# EAGLE design OSSIICB (EAGLE 6.1)
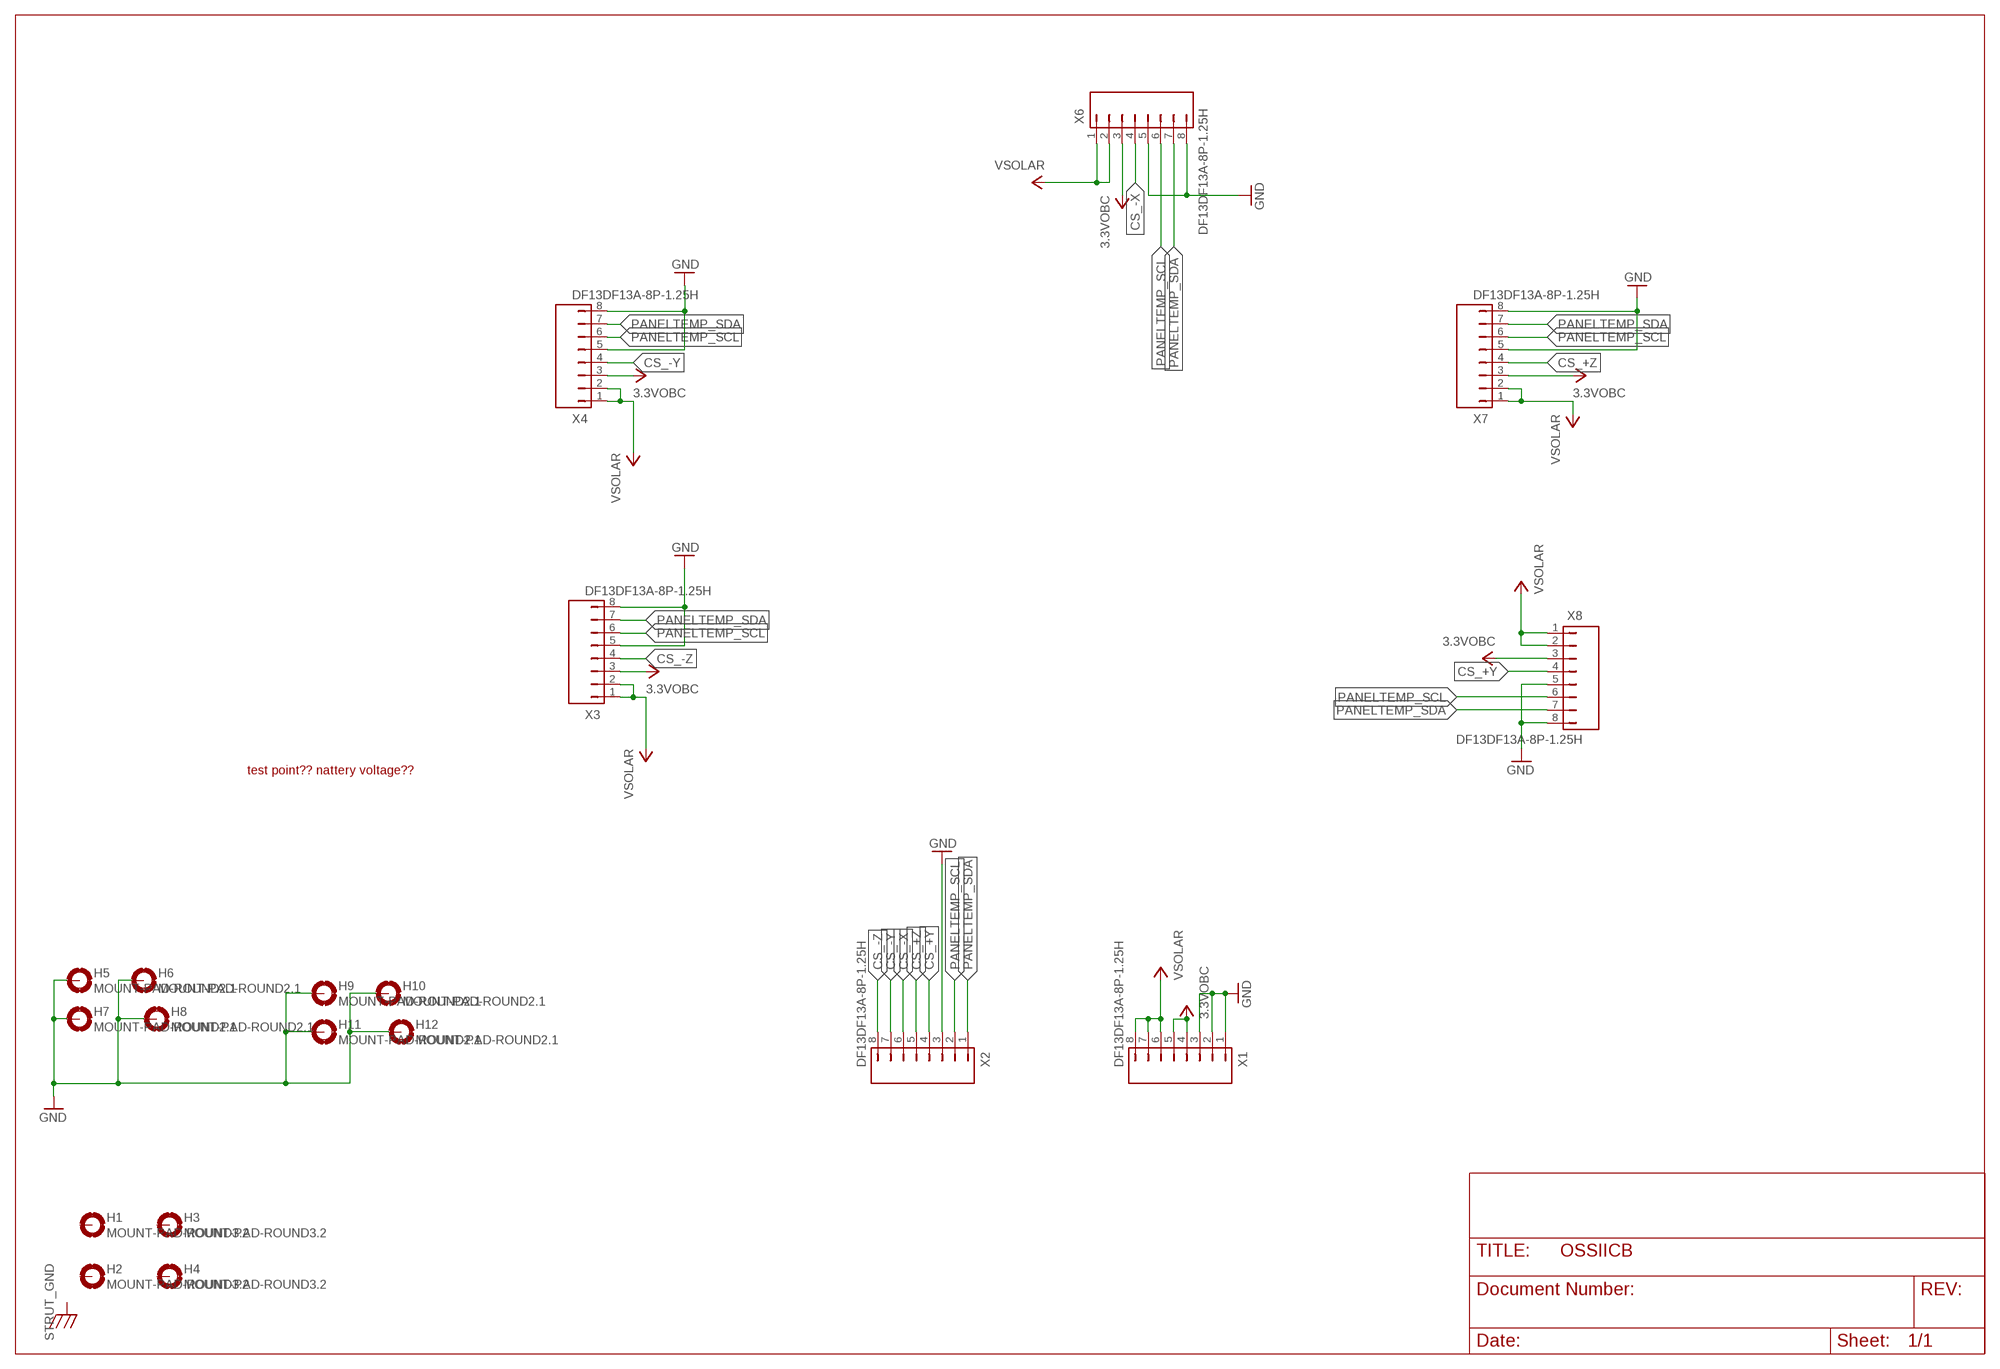
[diagram p0: schematic, sheet 1]

## Parts
H1  MOUNT-PAD-ROUND3.2  [3.2-PAD-ROUND]
H2  MOUNT-PAD-ROUND3.2  [3.2-PAD-ROUND]
H3  MOUNT-PAD-ROUND3.2  [3.2-PAD-ROUND]
H4  MOUNT-PAD-ROUND3.2  [3.2-PAD-ROUND]
H5  MOUNT-PAD-ROUND2.1  [2.1-PAD-ROUND]
H6  MOUNT-PAD-ROUND2.1  [2.1-PAD-ROUND]
H7  MOUNT-PAD-ROUND2.1  [2.1-PAD-ROUND]
H8  MOUNT-PAD-ROUND2.1  [2.1-PAD-ROUND]
H9  MOUNT-PAD-ROUND2.1  [2.1-PAD-ROUND]
H10  MOUNT-PAD-ROUND2.1  [2.1-PAD-ROUND]
H11  MOUNT-PAD-ROUND2.1  [2.1-PAD-ROUND]
H12  MOUNT-PAD-ROUND2.1  [2.1-PAD-ROUND]
X1  DF13DF13A-8P-1.25H  [DF13A-8P]
X2  DF13DF13A-8P-1.25H  [DF13A-8P]
X3  DF13DF13A-8P-1.25H  [DF13A-8P]
X4  DF13DF13A-8P-1.25H  [DF13A-8P]
X6  DF13DF13A-8P-1.25H  [DF13A-8P]
X7  DF13DF13A-8P-1.25H  [DF13A-8P]
X8  DF13DF13A-8P-1.25H  [DF13A-8P]

## Nets
3.3VOBC: X1.4 X1.5 X3.3 X4.3 X6.3 X7.3 X8.3
CS_+Y: X2.4 X8.4
CS_+Z: X2.5 X7.4
CS_-X: X2.6 X6.4
CS_-Y: X2.7 X4.4
CS_-Z: X2.8 X3.4
GND: H5.B3,2(MOUNT) H6.B3,2(MOUNT) H7.B3,2(MOUNT) H8.B3,2(MOUNT) H9.B3,2(MOUNT) H10.B3,2(MOUNT) H11.B3,2(MOUNT) H12.B3,2(MOUNT) X1.1 X1.2 X1.3 X2.3 X3.5 X3.8 X4.5 X4.8 X6.5 X6.8 X7.5 X7.8 X8.5 X8.8
PANELTEMP_SCL: X2.2 X3.6 X4.6 X6.6 X7.6 X8.6
PANELTEMP_SDA: X2.1 X3.7 X4.7 X6.7 X7.7 X8.7
VSOLAR: X1.6 X1.7 X1.8 X3.1 X3.2 X4.1 X4.2 X6.1 X6.2 X7.1 X7.2 X8.1 X8.2
Unconnected: H1.B3,2(MOUNT) H2.B3,2(MOUNT) H3.B3,2(MOUNT) H4.B3,2(MOUNT)

## Notes on the sheet
- test point?? nattery voltage??

## Library data of the parts
H1-H12 = OSSI:MOUNT-PAD-ROUND
X1-X4 X6-X8 = OSSI:DF13: Hirose DF13 series connector

## Board
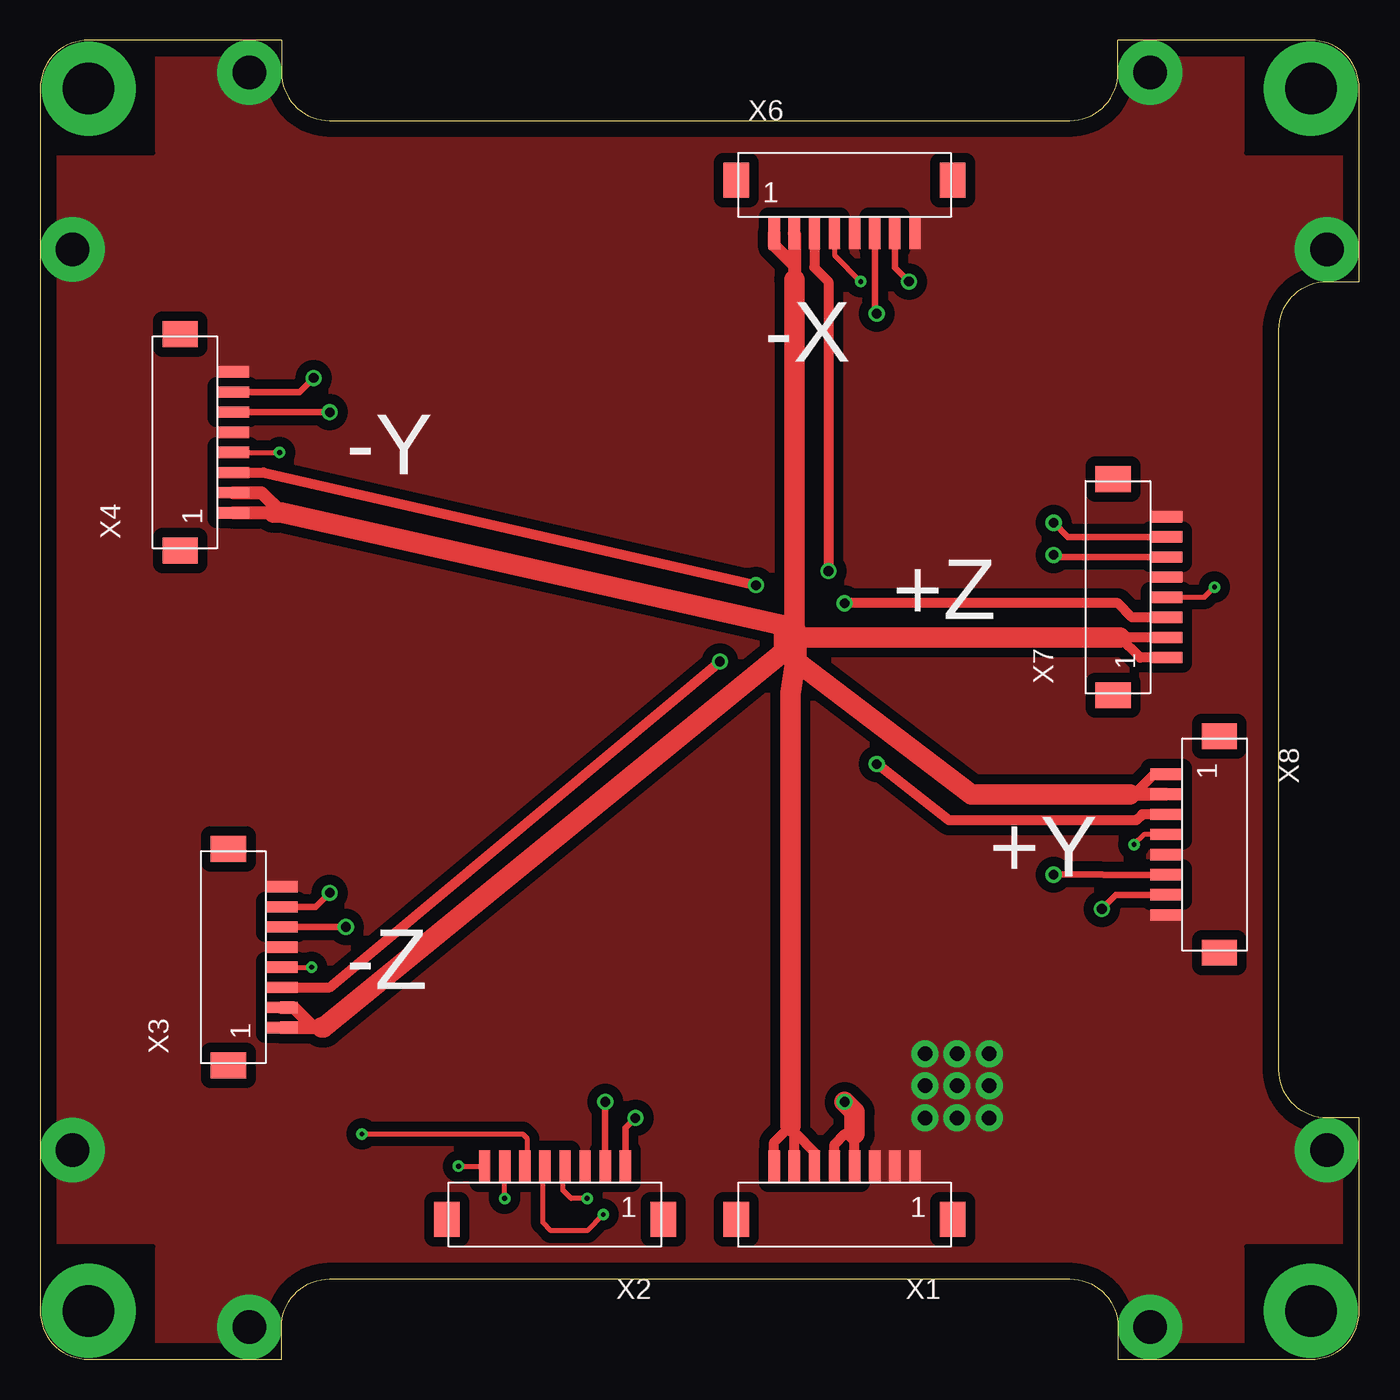
[diagram p1: board, top side]
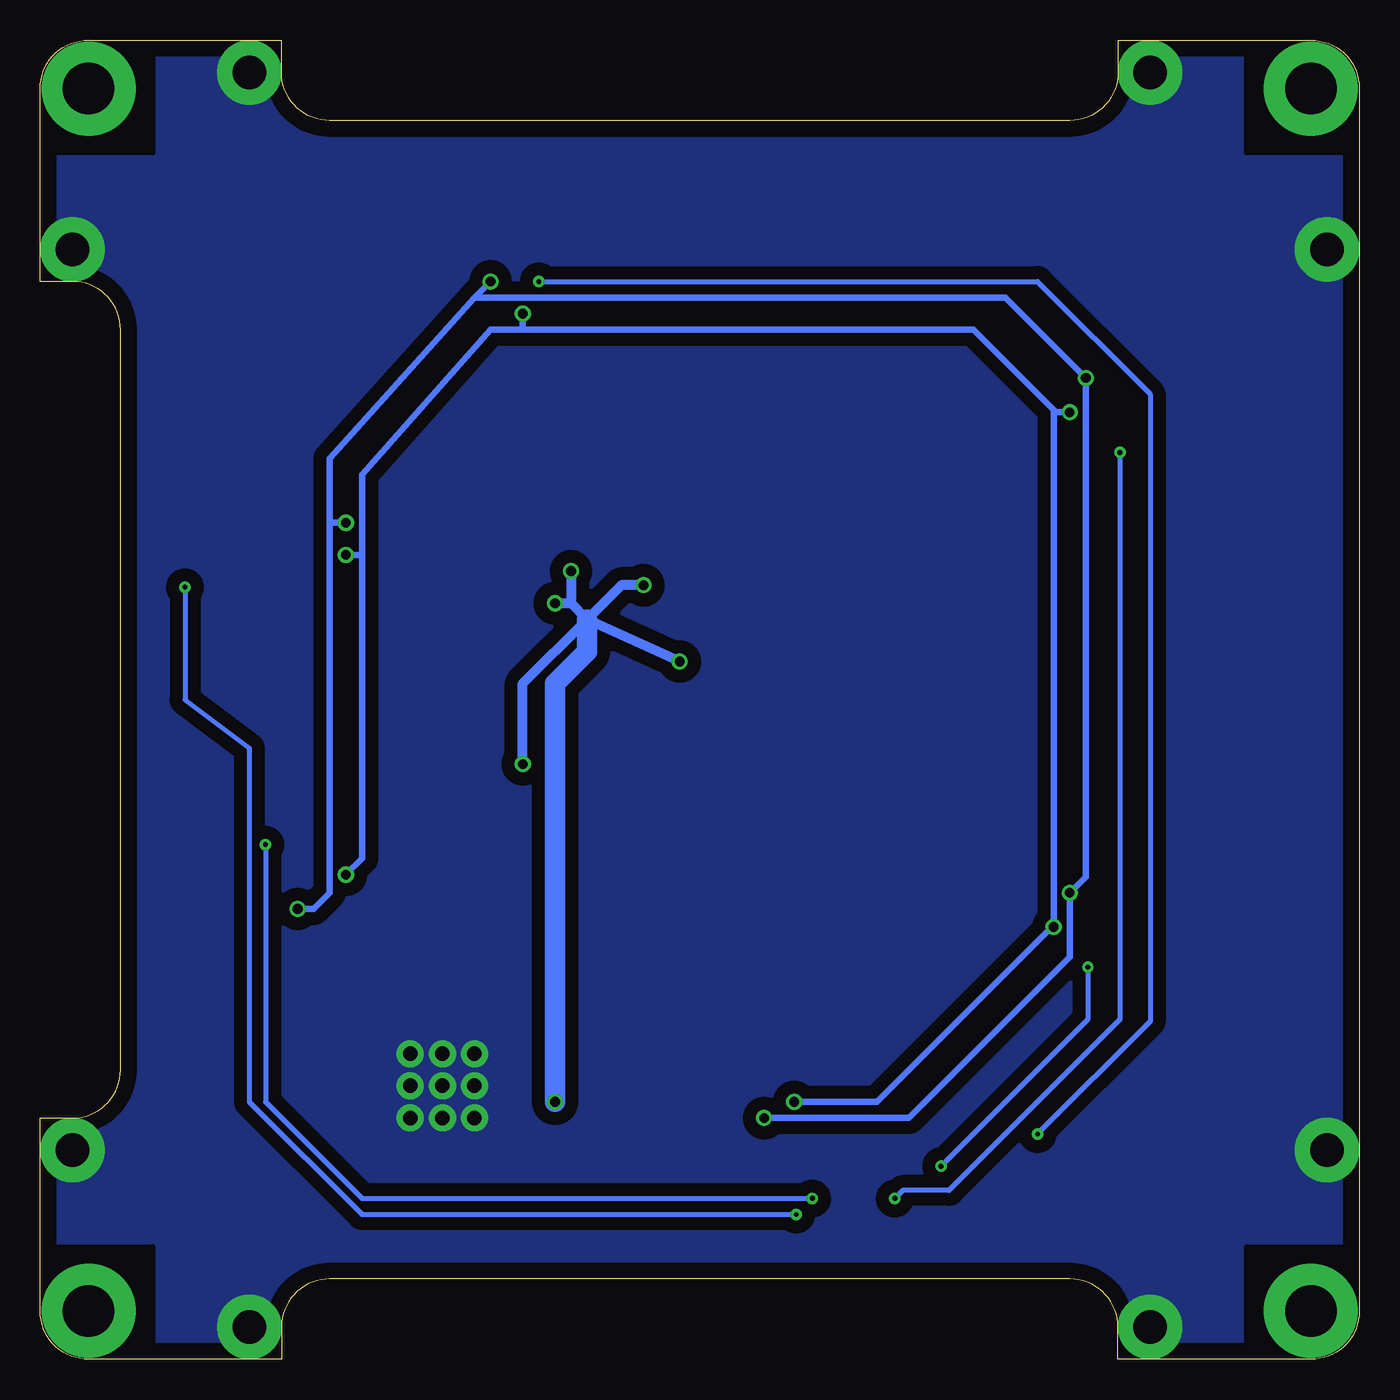
[diagram p2: board, bottom side, seen from below]

Size 82 x 82 mm. Coordinates in mm from the lower left corner, seen from the top.
Outline: 0,15 0,3 arc90 3,0 15,0 15,2 arc-90 18,5 64,5 arc-90 67,2 67,0 79,0 arc90 82,3 82,15 80,15 arc-90 77,18 77,64 arc-90 80,67 82,67 82,79 arc90 79,82 67,82 67,80 arc-90 64,77 18,77 arc-90 15,80 15,82 3,82 arc90 0,79 0,15
Copper layers (1*16): Top 0.035mm / dielectric 1.5mm / Bottom 0.035mm
Design rules: minimum track width 10mil, minimum drill 24mil, track to track 8mil, track to pad 8mil, pad to pad 8mil, via to via 8mil, smd to smd 8mil, copper to edge 40mil, drill to drill 8mil, minimum pad ring 10mil, minimum via ring 8mil, stop-mask expansion 4mil, vias tented up to drill 0mil, thermal gap 10mil

### Footprints (pad centres in the part's own frame; a part is rotated, then mirrored left to right if it is on the bottom)
3.2-PAD-ROUND = drill 3.2 pad 5.842: B3,2 0,0
2.1-PAD-ROUND = drill 2.1 pad 4: B3,2 0,0
DF13A-8P = smd 0.7 x 2: 1 -4.375,0; 2 -3.125,0; 3 -1.875,0; 4 -0.625,0; 5 0.625,0; 6 1.875,0; 7 3.125,0; 8 4.375,0 | smd 1.6 x 2.2: P$1 -6.725,3.3; P$2 6.725,3.3

### Placement (x,y rotation side)
H1  3,3 0 top
H2  3,79 0 top
H3  79,79 0 top
H4  79,3 0 top
H5  69,2 0 top
H6  13,2 0 top
H7  2,13 0 top
H8  2,69 0 top
H9  13,80 0 top
H10  80,69 0 top
H11  69,80 0 top
H12  80,13 0 top
X1  50,12 180 top
X2  32,12 180 top
X3  15,25 90 top
X4  12,57 90 top
X6  50,70 0 top
X7  70,48 90 top
X8  70,32 270 top

### Tracks (layer width: path | path; a pad name or v marks a point on that pad's centre or on a via)
3.3VOBC  (via drill 0.6)
  Top 0.61: X1.4 50.62,14 50,14 49.38,13.38 X1.5 | X7.3 67.88,46.12 67,47 v50,47 | X6.3 48.12,67.88 49,67 v49,49 | X4.3 13.88,55.12 v44.5,48.12 | X3.3 18,23.12 v42.25,43.38 | X8.3 68.5,33.88 68.12,33.5 56.5,33.5 v52,37
  Top 1.27: 50.62,14 50.62,15.38 v50,16
  Bottom 0.61: 48,46 49,47 | v50,47 49,47 | v49,49 49,47 | v44.5,48.12 45.88,48.12 48,46 | v42.25,43.38 48,46 | v52,37 52,42 48,46
  Bottom 1.27: v50,16 50,42 48,44 48,46
CS_+Y  (via drill 0.3)
  Top 0.305: X8.4 68.62,32.62 v68,32 | v34,10 33,10 32.5,10.5 32.5,11.88 X2.4
  Bottom 0.305: v68,32 68,16 62,10 v34,10
CS_+Z  (via drill 0.3)
  Top 0.305: X7.4 72.38,47.38 v73,48 | v35,9 34,8 31.75,8 31.25,8.5 31.25,11.88 X2.5
  Bottom 0.305: v73,48 73,41 69,38 69,16 62,9 v35,9
CS_-X  (via drill 0.3)
  Top 0.305: X6.4 49.38,68.62 v51,67 | v20,14 30,14 30.25,13.75 30.25,12.12 X2.6
  Bottom 0.305: v51,67 20,67 13,60 13,21 v20,14
CS_-Y  (via drill 0.3)
  Top 0.305: X4.4 v14.88,56.38 | v28.88,10 X2.7
  Bottom 0.305: v14.88,56.38 14.88,21.12 25.5,10.5 28.38,10.5 v28.88,10
CS_-Z  (via drill 0.3)
  Top 0.305: X3.4 v16.88,24.38 | v26,12 X2.8
  Bottom 0.305: v16.88,24.38 16.88,21.12 v26,12
GND  (via drill 0.9 pad 1.68)
  other vias: 55,17 55,19 57,19 57,17 55,15 57,15 59,19 59,17 59,15
  pour Top (isolate 0.61, no thermals): 0,82 82,82 82,0 0,0
  pour Bottom (isolate 0.813, no thermals): 0,82 82,82 82,0 0,0
N$1
  cutout Top: 0,82 0,75 7,75 7,82
  cutout Top: 75,82 75,75 82,75 82,82
  cutout Top: 75,7 75,0 82,0 82,7
  cutout Top: 0,7 0,0 7,0 7,7
N$2
  cutout Bottom: 0,82 0,75 7,75 7,82
  cutout Bottom: 75,82 75,75 82,75 82,82
  cutout Bottom: 75,7 75,0 82,0 82,7
  cutout Bottom: 0,7 0,0 7,0 7,7
PANELTEMP_SCL  (via drill 0.6)
  Top 0.406: X3.6 v19,26.88 | X4.6 15.88,58.88 16,58.88 v18,58.88 | X6.6 51.88,65.12 v52,65 | X7.6 63.12,49.88 v63,50 | X8.6 66.12,30.12 66,30.12 v63,30.12 | X2.2 35.12,15.88 v35.12,16
  Bottom 0.406: v19,26.88 19,27 | 19,27 | 19,27 19,29 19,58.88 | 19,58.88 19,59 24,64 52,64 | 52,64 54,64 62,55 62,50 | 62,50 62,31.12 v63,30.12 | v35.12,16 30,16 29,17 19,27 | v18,58.88 19,58.88 | v52,65 52,64 | v63,50 62,50
PANELTEMP_SDA  (via drill 0.6)
  Top 0.406: X4.7 16.12,60.12 v17,61 | X6.7 53.12,67.88 v54,67 | X7.7 63.88,51.12 v63,52 | X8.7 66.88,28.88 v66,28 | X2.1 36.38,14.38 v37,15 | X3.7 17.12,28.12 v18,29
  Bottom 0.406: v17,61 17,32 17,30 v18,29 18,25 28,15 v37,15 | v17,61 22,66 55,66 | 55,66 64,56 64,52 | 64,52 64,29 65,28 v66,28 | v17,61 | v54,67 55,66 | v63,52 64,52
VSOLAR
  Top 0.61: X7.2 67.12,44.88 68.38,43.62 X7.1 | X8.1 69.25,36.38 68,35.12 | X1.6 48.12,12.88 47,14 46.88,14 | X1.7 46.88,14 | 46.88,14 46.88,14.75 46.62,15 | X1.8 45.62,13.5 46.62,14.5
  Top 0.813: X6.2 46.88,68 | 46.88,68 46.88,67.12 | X4.1 14.5,52.62 | X3.1 17,20.62 | 17,20.62 17.5,20.62 | X3.2 15.75,21.88 17,20.62 | X4.2 13.75,53.88 15,52.62 | X6.1 45.62,69.25 46.88,68 | X8.2 68,35.12 67.75,35.12
  Top 1.27: 46.62,14.5 46.62,15 46.62,41.38 46.88,43 46.88,45.62 | 14.5,52.62 15,52.62 46.25,45.62 | 46.25,45.62 46.88,45.62 | 17.5,20.62 17.62,20.62 46.25,44 46.25,45.62 | 46.88,67.12 46.88,45.62 | 67.75,35.12 57.88,35.12 47,43.38 47,44.88 | 47,44.88 46.88,45.62 | 67.12,44.88 47,44.88

### Text on the board
tPlace: -X | -Y | +Z | +Y | -Z